# Altium schematic sheet 6-Power Supply.SchDoc
size 594 x 420 mm; SheetNumber: 6; SheetTotal: 7; PageSetup: Record=PageOptions|CenterHorizontal=False|CenterVertical=False|PrintScale=0.43|XCorrection=0.00|YCorrection=0.00|PrintKind=1|BorderSize=5000000|LeftOffset=0|BottomOffset=0|Orientation=2|PaperLength=5940|PaperWidth=4200|Scale=100|PaperSource=7|PrintQuality=-4|MediaType=1|DitherType=10|PaperKind=Personal. 1: 215,9 x 279,4 mm|PrintScaleMode=0; NumTotalFolhas: 7; NumFolha: 6
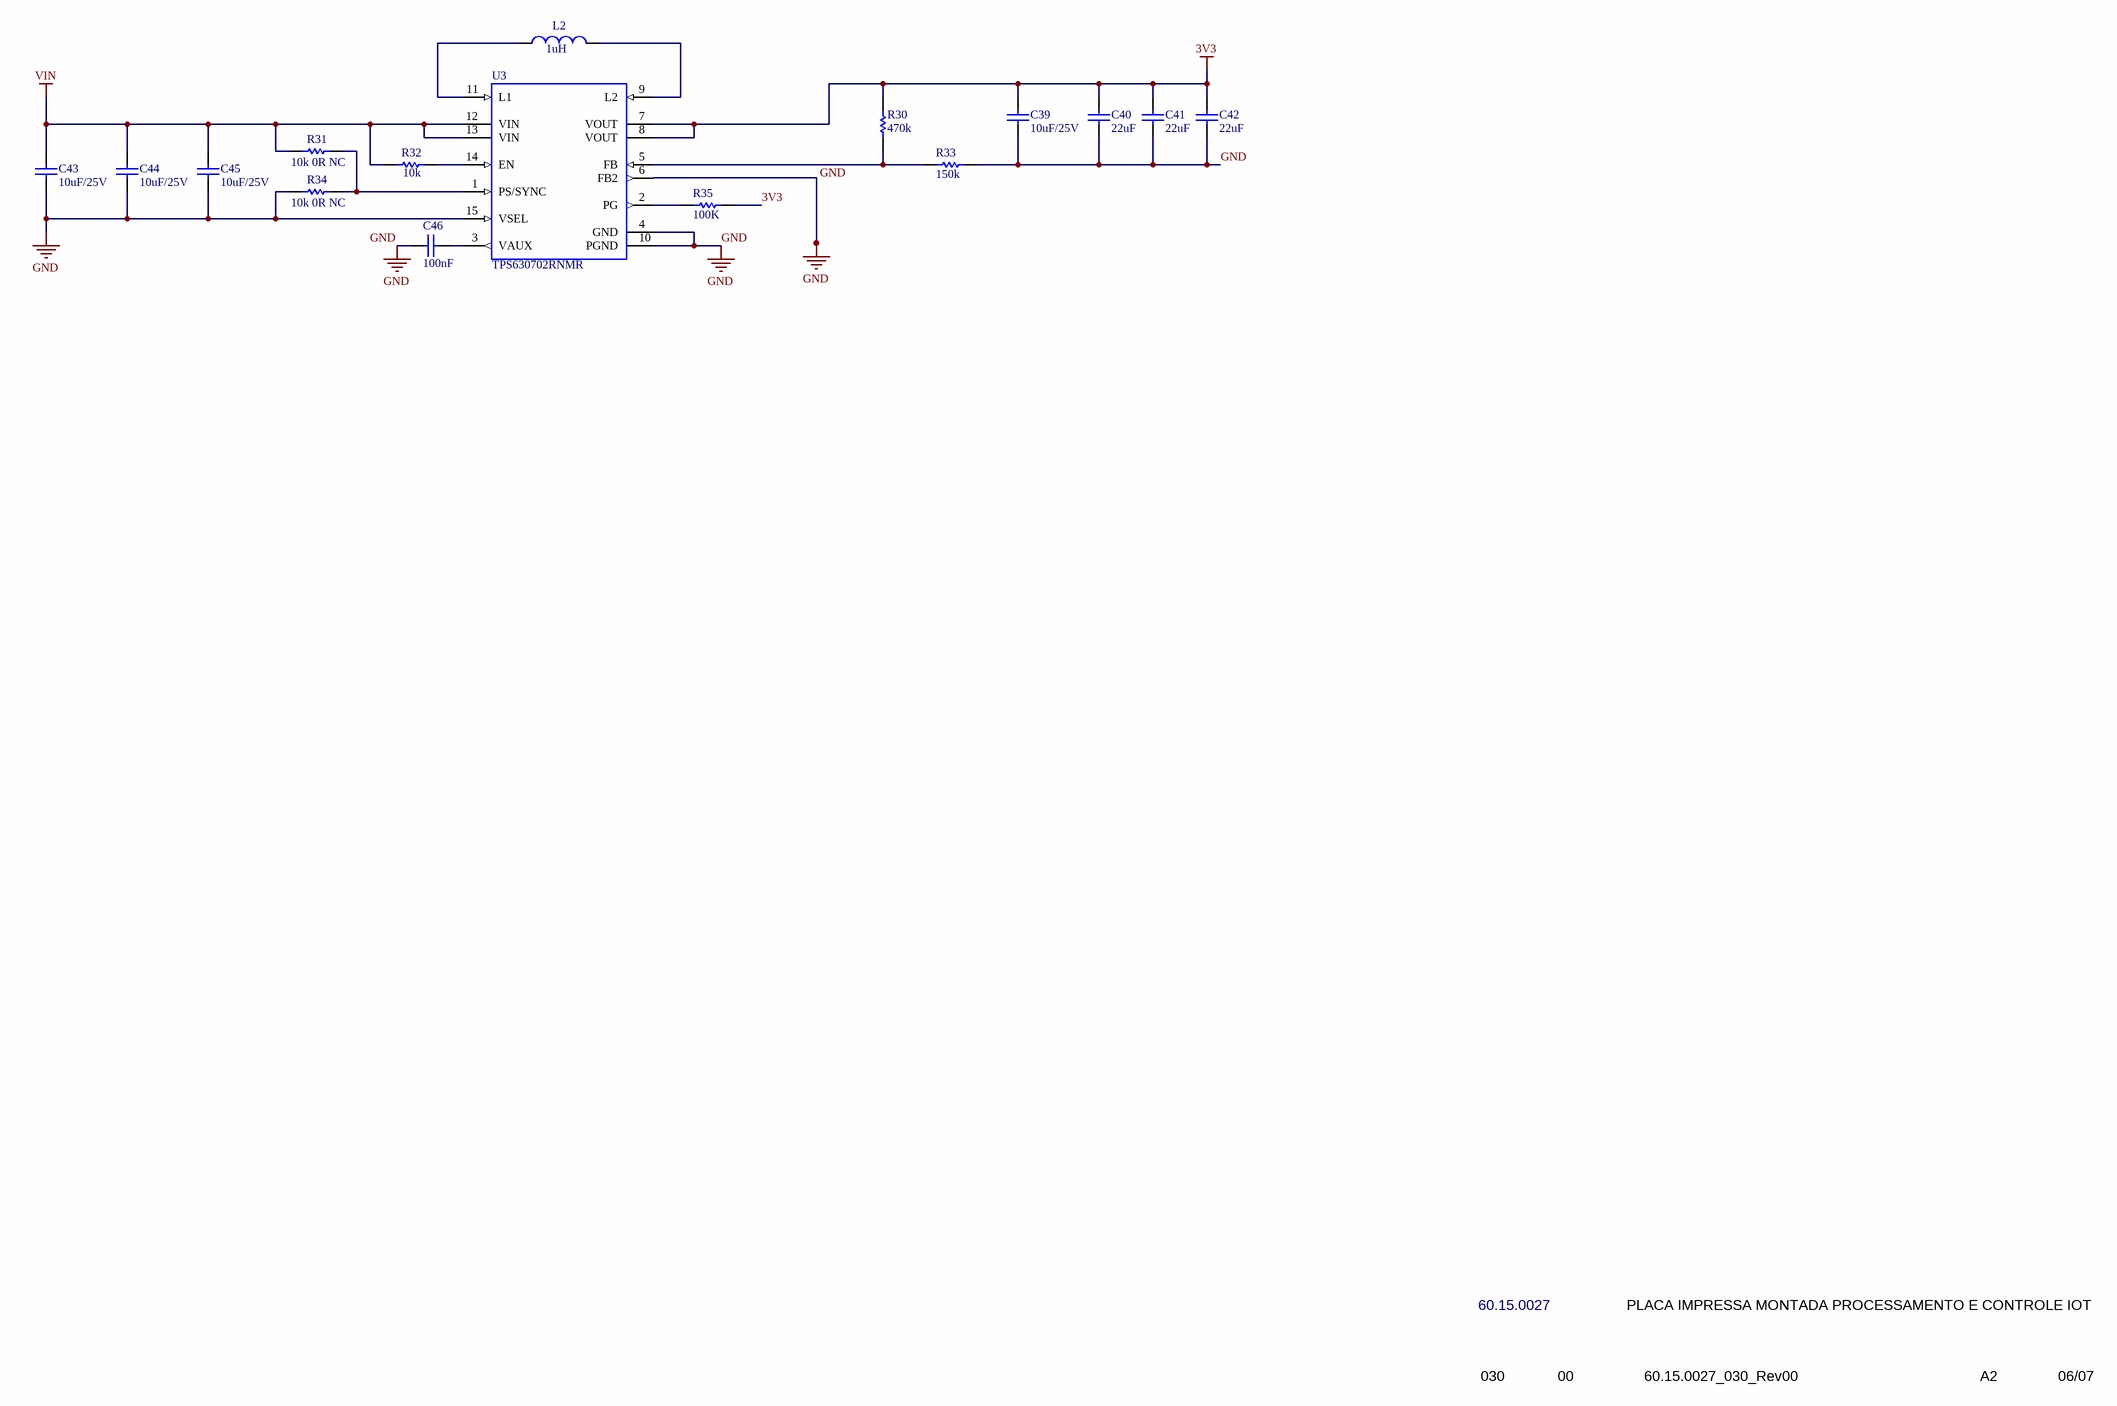
[diagram p0: 6-Power Supply.SchDoc]

## Parts
C39  value 10uF/25V  [16.23.0733]  (hidden comment: 16.23.0733)
C40  16.23.0428  [16.23.0428]  (value not drawn)
C41  16.23.0428  [16.23.0428]  (value not drawn)
C42  16.23.0428  [16.23.0428]  (value not drawn)
C43  value 10uF/25V  [16.23.0735]  (hidden comment: 16.23.0735)
C44  value 10uF/25V  [16.23.0735]  (hidden comment: 16.23.0735)
C45  value 10uF/25V  [16.23.0733]  (hidden comment: 16.23.0733)
C46  value 100nF  [16.23.0807]  (hidden comment: 16.23.0807)
L2  value 1uH  [40.12.0346]  (hidden comment: 40.12.0346)
R30  value 470k  [66.21.1644]  (hidden comment: 66.21.1644)
R31  value 10k 0R NC  [66.21.1646]  (hidden comment: 66.21.1646)
R32  value 10k  [66.21.1646]  (hidden comment: 66.21.1646)
R33  value 150k  [66.21.1645]  (hidden comment: 66.21.1645)
R34  value 10k 0R NC  [66.21.1646]  (hidden comment: 66.21.1646)
R35  value 100K  [66.24.1346]  (hidden comment: 66.24.1346)
U3  value TPS630702RNMR  [26.24.0200]  (hidden comment: 26.24.0200)

## Nets
3V3: C39.2 C40.2 C41.2 C42.2 R30.2 R35.2 U3.7(VOUT) U3.8(VOUT)
GND: C39.1 C40.1 C41.1 C42.1 C43.1 C44.1 C45.1 C46.1 R33.2 R34.1 U3.4(GND) U3.6(FB2) U3.10(PGND) U3.15(VSEL)
VIN: C43.2 C44.2 C45.2 R31.1 R32.1 U3.12(VIN) U3.13(VIN)
NetC46_2: C46.2 U3.3(VAUX)
NetL2_1: L2.1 U3.11(L1)
NetL2_2: L2.2 U3.9(L2)
NetR30_1: R30.1 R33.1 U3.5(FB)
NetR31_2: R31.2 R34.2 U3.1(PS/SYNC)
NetR32_2: R32.2 U3.14(EN)
NetR35_1: R35.1 U3.2(PG)

## Notes on the sheet
- 60.15.0027
- PLACA IMPRESSA MONTADA PROCESSAMENTO E CONTROLE IOT
- 030
- 00
- 60.15.0027_030_Rev00
- A2
- 06/07
- Labels drawn without touching a wire or pin: GND
- 1
- 2
- 3
- 4
- 5
- 6
- 7
- 8
- A
- B
- C
- D
- E
- F
- G
- H
- DOCUMENTO DE ENGENHARIA DE PRODUTO
- DOCUMENT OF PRODUCT ENGINEERING
- CÓDIGO / CODE
- DESCRIÇÃO / DESCRIPTION
- DOC
- REV
- ARQUIVO / FILE
- FORM./SIZE
- FOLHA / PAGE
- (in symbol 16.23.0428) 22uF

## Library data of the parts
C39 C45 = 16.23.0733: CAPACITOR CERAMICO MULTICAMADAS 10uF 25V 20% SMD 0603 X5R; Part Number: GRM188R61E106MA73; Fabricante: Murata
C40-C42 = 16.23.0428: CC MUL 22uF 16V X5R 20% SMD 0805
C43 C44 = 16.23.0735: CAPACITOR CERAMICO MULTICAMADAS 10uF 25V 10% SMD 0805 X5R; Part Number: GRM21BR61E106KA73; Fabricante: Murata
C46 = 16.23.0807: CAPACITOR CERAMICO MULTICAMADAS 100nF 50V X7R 10% SMD 0402
L2 = 40.12.0346: INDUTOR FIXO 1uH 20% 5A 36mOHM SMD 1008
R30 = 66.21.1644: RESISTOR THICK FILM 470k OHMS 25V 0.05W 1% SMD 0201
R31 R32 R34 = 66.21.1646: RESISTOR THICK FILM 10k OHMS 25V 0.05W 1% SMD 0201
R33 = 66.21.1645: RESISTOR THICK FILM 150k OHMS 25V 0.05W 1% SMD 0201
R35 = 66.24.1346: RESISTOR THICK FILM 50mW 100K OHMS 1% SMD 0201
U3 = 26.24.0200: CI REGULADOR TENSAO CHAV AJUST 2A16V 2A DESC SAIDA VQFN-HR